# Altium schematic sheet STM32CC.SchDoc
size A3
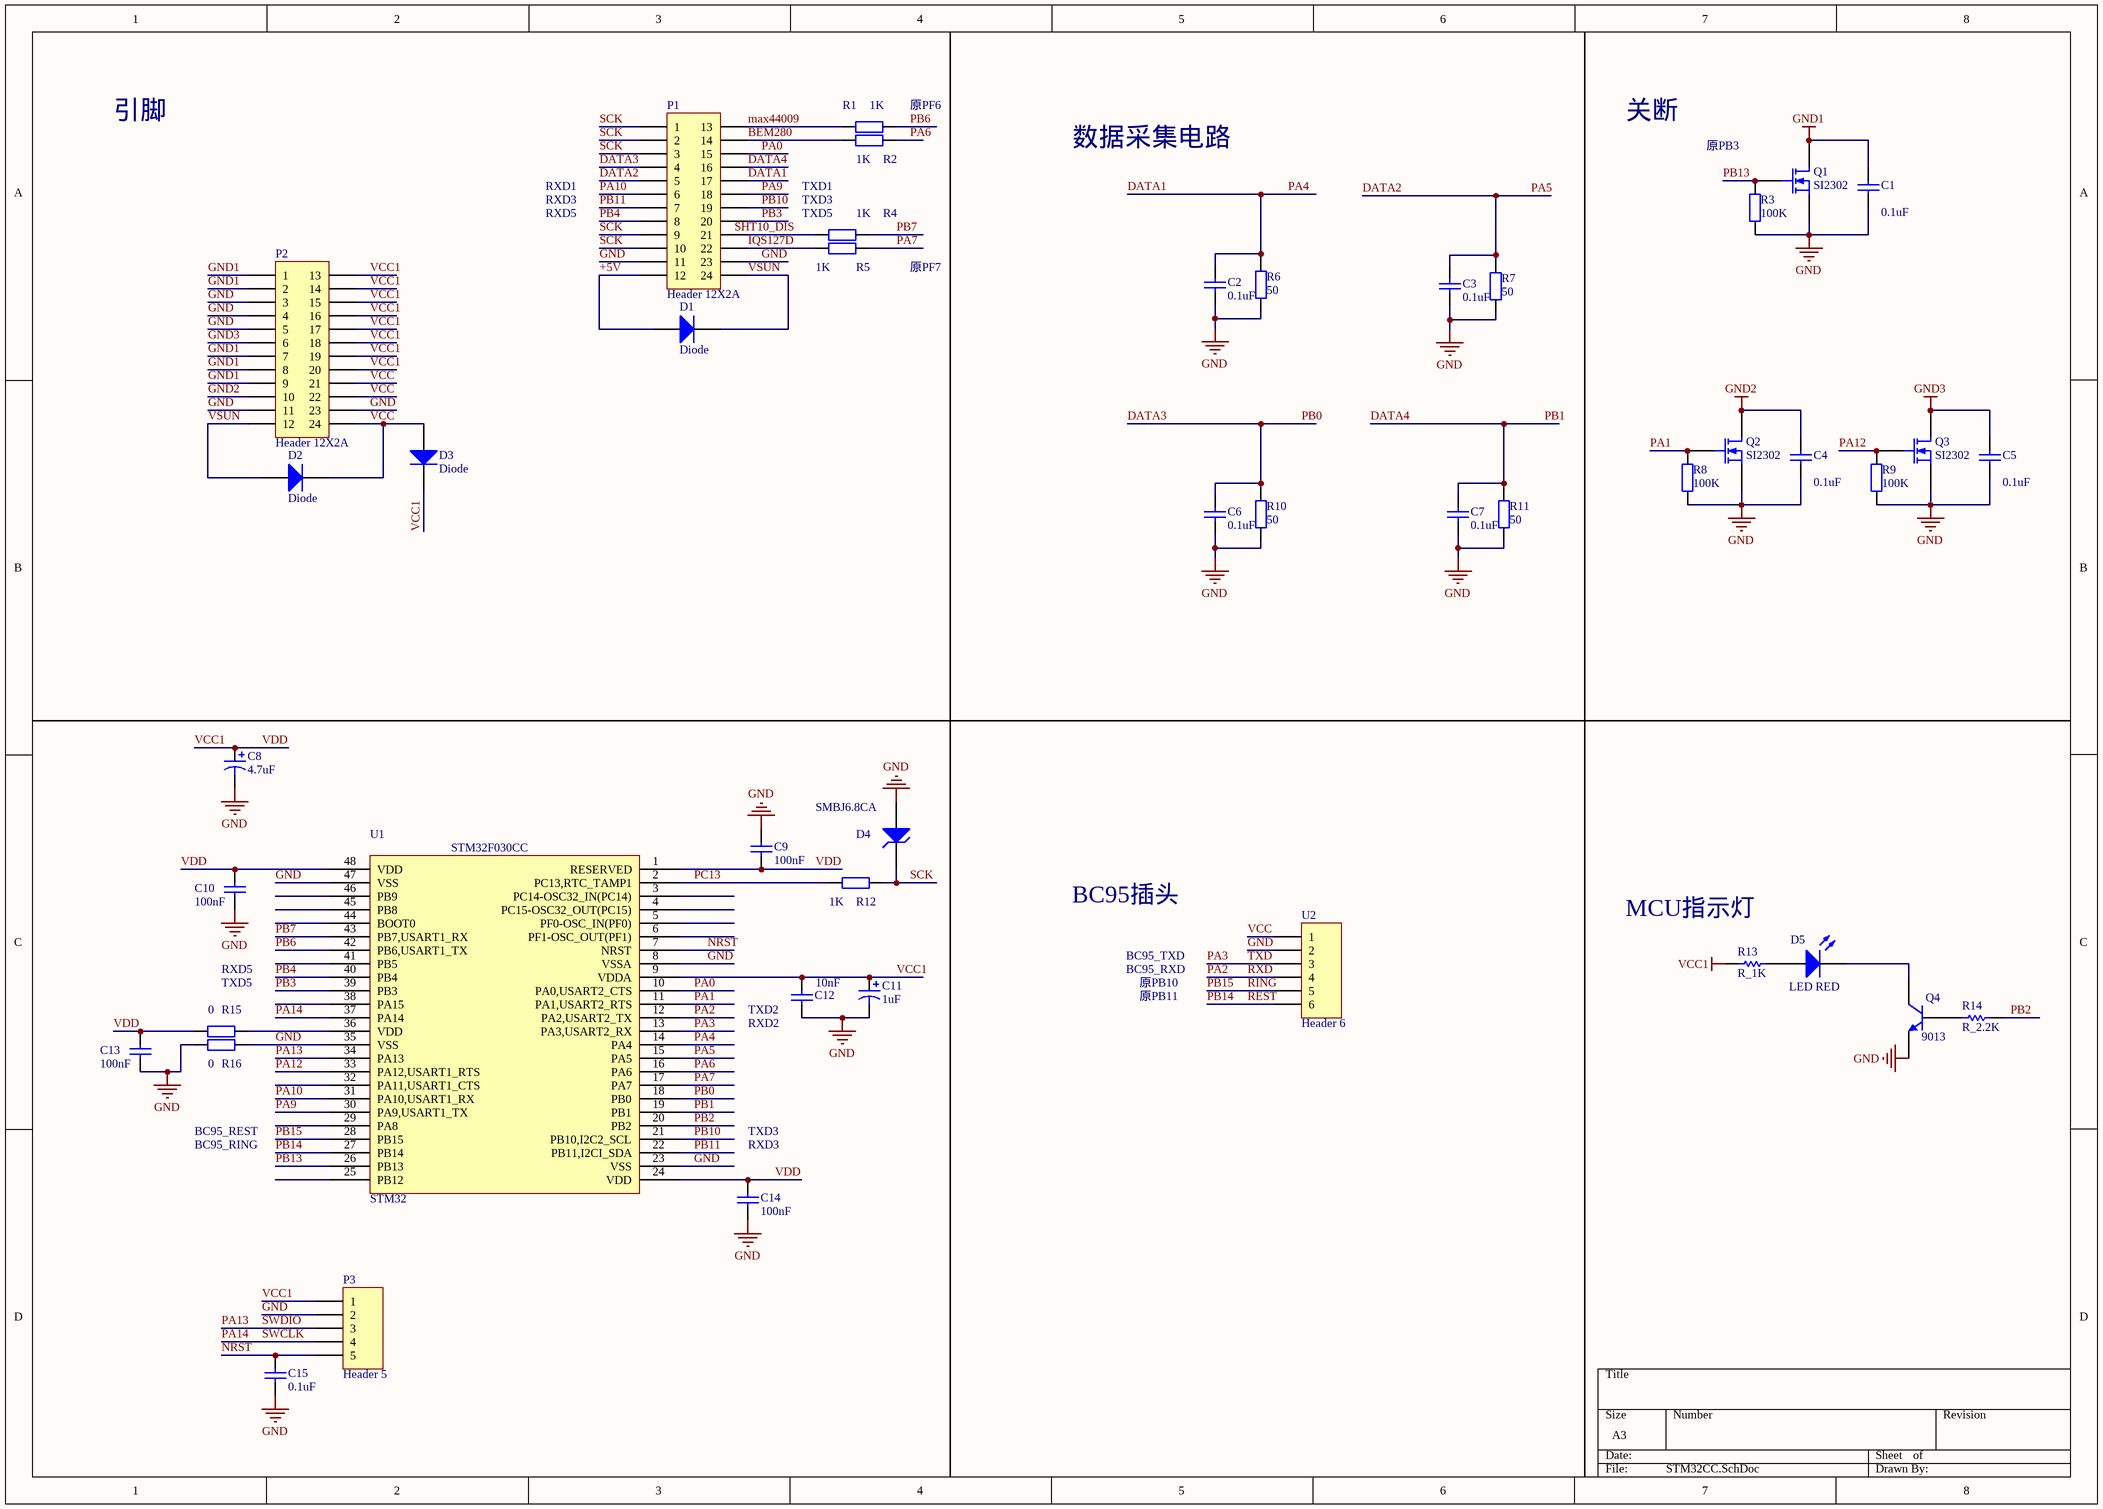
[diagram p0: STM32CC.SchDoc]

## Parts
C1  value 0.1uF  [0603]  (hidden comment: Cap)
C2  value 0.1uF  [0603]  (hidden comment: C_0.1uF)
C3  value 0.1uF  [0603]  (hidden comment: C_0.1uF)
C4  value 0.1uF  [0603]  (hidden comment: Cap)
C5  value 0.1uF  [0603]  (hidden comment: Cap)
C6  value 0.1uF  [0603]  (hidden comment: C_0.1uF)
C7  value 0.1uF  [0603]  (hidden comment: C_0.1uF)
C8  4.7uF  [1206]
C9  100nF  [0603]
C10  100nF  [0603]
C11  1uF  [1206]
C12  10nF  [0603]
C13  100nF  [0603]
C14  100nF  [0603]
C15  0.1uF  [0603]
D1  Diode  [1N4007-M7]
D2  Diode  [1N4007-M7]
D3  Diode  [1N4007-M7]
D4  SMBJ6.8CA  [DO-214AB]
D5  LED RED  [LED-3mm]
P1  Header 12X2A  [HDR2X12_CEN]
P2  Header 12X2A  [HDR2X12_CEN]
P3  Header 5  [HDR1X5]
Q1  SI2302  [SOT23-3]
Q2  SI2302  [SOT23-3]
Q3  SI2302  [SOT23-3]
Q4  9013  [SOT-23]
R1  1K  [0603]
R2  1K  [0603]
R3  100K  [0603]
R4  1K  [0603]
R5  1K  [0603]
R6  value 50  [0805]  (hidden comment: 50R)
R7  value 50  [0805]  (hidden comment: 50R)
R8  100K  [0603]
R9  100K  [0603]
R10  value 50  [0805]  (hidden comment: 50R)
R11  value 50  [0805]  (hidden comment: 50R)
R12  1K  [0603]
R13  R_1K  [0603]
R14  R_2.2K  [0603]
R15  0  [0603]
R16  0  [0603]
U1  STM32  [LQFP48_N]
U2  Header 6  [PCBComponent_1]

## Nets
GND: C1.1 C2.2 C3.2 C4.1 C5.1 C6.2 C7.2 C8.2 C9.2 C10.1 C11.2 C12.1 C13.1 C14.1 C15.2 D4.1(A) P1.11 P1.23 P2.3 P2.4 P2.5 P2.11 P2.23 P3.2 Q1.2(S) Q2.2(S) Q3.2(S) Q4.2(E) R3.1 R6.1 R7.1 R8.1 R9.1 R10.1 R11.1 R16.1 R16.2 U1.8(VSSA) U1.23(VSS) U1.35(VSS) U1.47(VSS) U2.2
GND1: C1.2 P2.1 P2.2 P2.7 P2.8 P2.9 Q1.3(D)
GND2: C4.2 P2.10 Q2.3(D)
GND3: C5.2 P2.6 Q3.3(D)
VCC1: C8.1 C9.1 C10.2 C11.1 C12.2 C13.2 C14.2 D3.2(K) P2.13 P2.14 P2.15 P2.16 P2.17 P2.18 P2.19 P2.20 P3.1 R13.1 R15.1 U1.1(RESERVED) U1.9(VDDA) U1.24(VDD) U1.48(VDD)  [also labelled VDD]
+5V: D1.1(A) P1.12
BEM280: P1.14 R2.1
DATA1: C2.1 P1.17 R6.2 U1.14(PA4)  [also labelled PA4]
DATA2: C3.1 P1.5 R7.2 U1.15(PA5)  [also labelled PA5]
DATA3: C6.1 P1.4 R10.2 U1.18(PB0)  [also labelled PB0]
DATA4: C7.1 P1.16 R11.2 U1.19(PB1)  [also labelled PB1]
IQS127D: P1.22 R5.1
max44009: P1.13 R1.1
NRST: C15.1 P3.5 U1.7(NRST)
PA0: P1.15 U1.10(PA0,USART2_CTS)
PA1: Q2.1(G) R8.2 U1.11(PA1,USART2_RTS)
PA2: U1.12(PA2,USART2_TX) U2.4  [also labelled RXD]
PA3: U1.13(PA3,USART2_RX) U2.3  [also labelled TXD]
PA6: R2.2 U1.16(PA6)
PA7: R5.2 U1.17(PA7)
PA9: P1.18 U1.30(PA9,USART1_TX)
PA10: P1.6 U1.31(PA10,USART1_RX)
PA12: Q3.1(G) R9.2 U1.33(PA12,USART1_RTS)
PA13: P3.3 U1.34(PA13)  [also labelled SWDIO]
PA14: P3.4 U1.37(PA14)  [also labelled SWCLK]
PB2: R14.2 U1.20(PB2)
PB3: P1.20 U1.39(PB3)
PB4: P1.8 U1.40(PB4)
PB6: R1.2 U1.42(PB6,USART1_TX)
PB7: R4.2 U1.43(PB7,USART1_RX)
PB10: P1.19 U1.21(PB10,I2C2_SCL)
PB11: P1.7 U1.22(PB11,I2CI_SDA)
PB13: Q1.1(G) R3.2 U1.26(PB13)
PB14: U1.27(PB14) U2.6  [also labelled REST]
PB15: U1.28(PB15) U2.5  [also labelled RING]
PC13: R12.1 U1.2(PC13,RTC_TAMP1)
SCK: D4.2(K) P1.1 P1.2 P1.3 P1.9 P1.10 R12.2
VCC: D2.2(K) D3.1(A) P2.21 P2.22 P2.24 U2.1
VSUN: D1.2(K) D2.1(A) P1.24 P2.12
NetD5_1: D5.1(A) R13.2
NetD5_2: D5.2(K) Q4.3(C)
NetP1_21: P1.21 R4.1
NetQ4_1: Q4.1(B) R14.1
NetR15_2: R15.2 U1.36(VDD)

Not connected (* = marked no-connect by the designer): U1 3(PC14-OSC32_IN(PC14)) 4(PC15-OSC32_OUT(PC15)) 5(PF0-OSC_IN(PF0)) 6(PF1-OSC_OUT(PF1)) 25(PB12) 29(PA8) 32(PA11,USART1_CTS) 38(PA15) 41(PB5) 44(BOOT0) 45(PB8) 46(PB9)

## Notes on the sheet
- 原PF6
- 引脚
- 数据采集电路
- 关断
- 原PB3
- RXD3
- RXD5
- RXD1
- TXD3
- (near R4) TXD5
- TXD1
- 原PF7
- BC95插头
- MCU指示灯
- TXD5
- BC95_TXD
- BC95_RXD
- 原PB10
- (near C12) TXD2
- (near C12) RXD2
- 原PB11
- BC95_RING
- BC95_REST
- (near C14) RXD3
- Labels drawn without touching a wire or pin: SHT10_DIS
- (in symbol STM32) STM32F030CC

## Library data of the parts
C1 C4 C5 C9 C10 C12-C15 = Cap: Capacitor; Published: 8-Jun-2000; LatestRevisionDate: 17-Jul-2002; LatestRevisionNote: Re-released for DXP Platform.; PackageReference: RAD-0.3; Publisher: Altium Limited
  C9 C10 C13 C14: Value: 100nF
  C12: Value: 10nF
  C15: Value: 0.1uF
C2 C3 C6 C7 = Cap: 贴片电容 0603; Published: 8-Jun-2000; LatestRevisionDate: 17-Jul-2002; LatestRevisionNote: Re-released for DXP Platform.; PackageReference: RAD-0.3; Publisher: Altium Limited
C8 C11 = Cap Pol1: Polarized Capacitor (Radial); Published: 8-Jun-2000; LatestRevisionDate: 17-Jul-2002; LatestRevisionNote: Re-released for DXP Platform.; PackageReference: RB7.6-15; Publisher: Altium Limited
  C8: Value: 4.7uF
  C11: Value: 1uF
D1-D3 = Diode: Default Diode; Published: 8-Jun-2000; LatestRevisionDate: 17-Jul-2002; LatestRevisionNote: Re-released for DXP Platform.; PackageDocument: Sep-1996; PackageReference: SMC; Publisher: Altium Limited; Code_JEDEC: DO-214-AB
D4 = D Zener: Zener Diode; Published: 8-Jun-2000; LatestRevisionDate: 17-Jul-2002; LatestRevisionNote: Re-released for DXP Platform.; PackageReference: DIODE-0.7; Publisher: Altium Limited
D5 = LED0: 插件 发光二极管 5mm 绿发绿光; Published: 8-Jun-2000; LatestRevisionDate: 08-Jul-2005; LatestRevisionNote: Mech Layer 1 removed.; PackageReference: LED-0; Publisher: Altium Limited
P1 P2 = Header 12X2A: Header, 12-Pin, Dual row; LatestRevisionDate: 17-Jul-2002; LatestRevisionNote: Re-released for DXP Platform.; Publisher: Altium Limited
P3 = Header 5: Header, 5-Pin; LatestRevisionDate: 17-Jul-2002; LatestRevisionNote: Re-released for DXP Platform.; Publisher: Altium Limited
Q1-Q3 = MOSFET-N: N-Channel MOSFET; PackageDocument: 1995/1996; Published: 8-Jun-2000; LatestRevisionDate: 17-Jul-2002; LatestRevisionNote: Re-released for DXP Platform.; PackageReference: E3; Publisher: Altium Limited
Q4 = NPN: 贴片三极管MMBT5551 SOT-23; Published: 8-Jun-2000; LatestRevisionDate: 17-Jul-2002; LatestRevisionNote: Re-released for DXP Platform.; PackageReference: TO-226; Publisher: Altium Limited; Code_JEDEC: TO-226-AA
R1-R5 R8 R9 R12 R15 R16 = Res2: Resistor; Published: 8-Jun-2000; LatestRevisionDate: 17-Jul-2002; LatestRevisionNote: Re-released for DXP Platform.; PackageReference: AXIAL-0.4; Publisher: Altium Limited
  R1 R2 R4 R5 R12: Value: 1K
  R3 R8 R9: Value: 100K
  R15 R16: Value: 0
R6 R7 R10 R11 = Res2: 贴片电阻 0805 精度0.1%; Published: 8-Jun-2000; LatestRevisionDate: 17-Jul-2002; LatestRevisionNote: Re-released for DXP Platform.; PackageReference: AXIAL-0.4; Publisher: Altium Limited
R13 R14 = Resistor
U2 = Header 6: Header, 6-Pin; LatestRevisionDate: 17-Jul-2002; LatestRevisionNote: Re-released for DXP Platform.; Publisher: Altium Limited